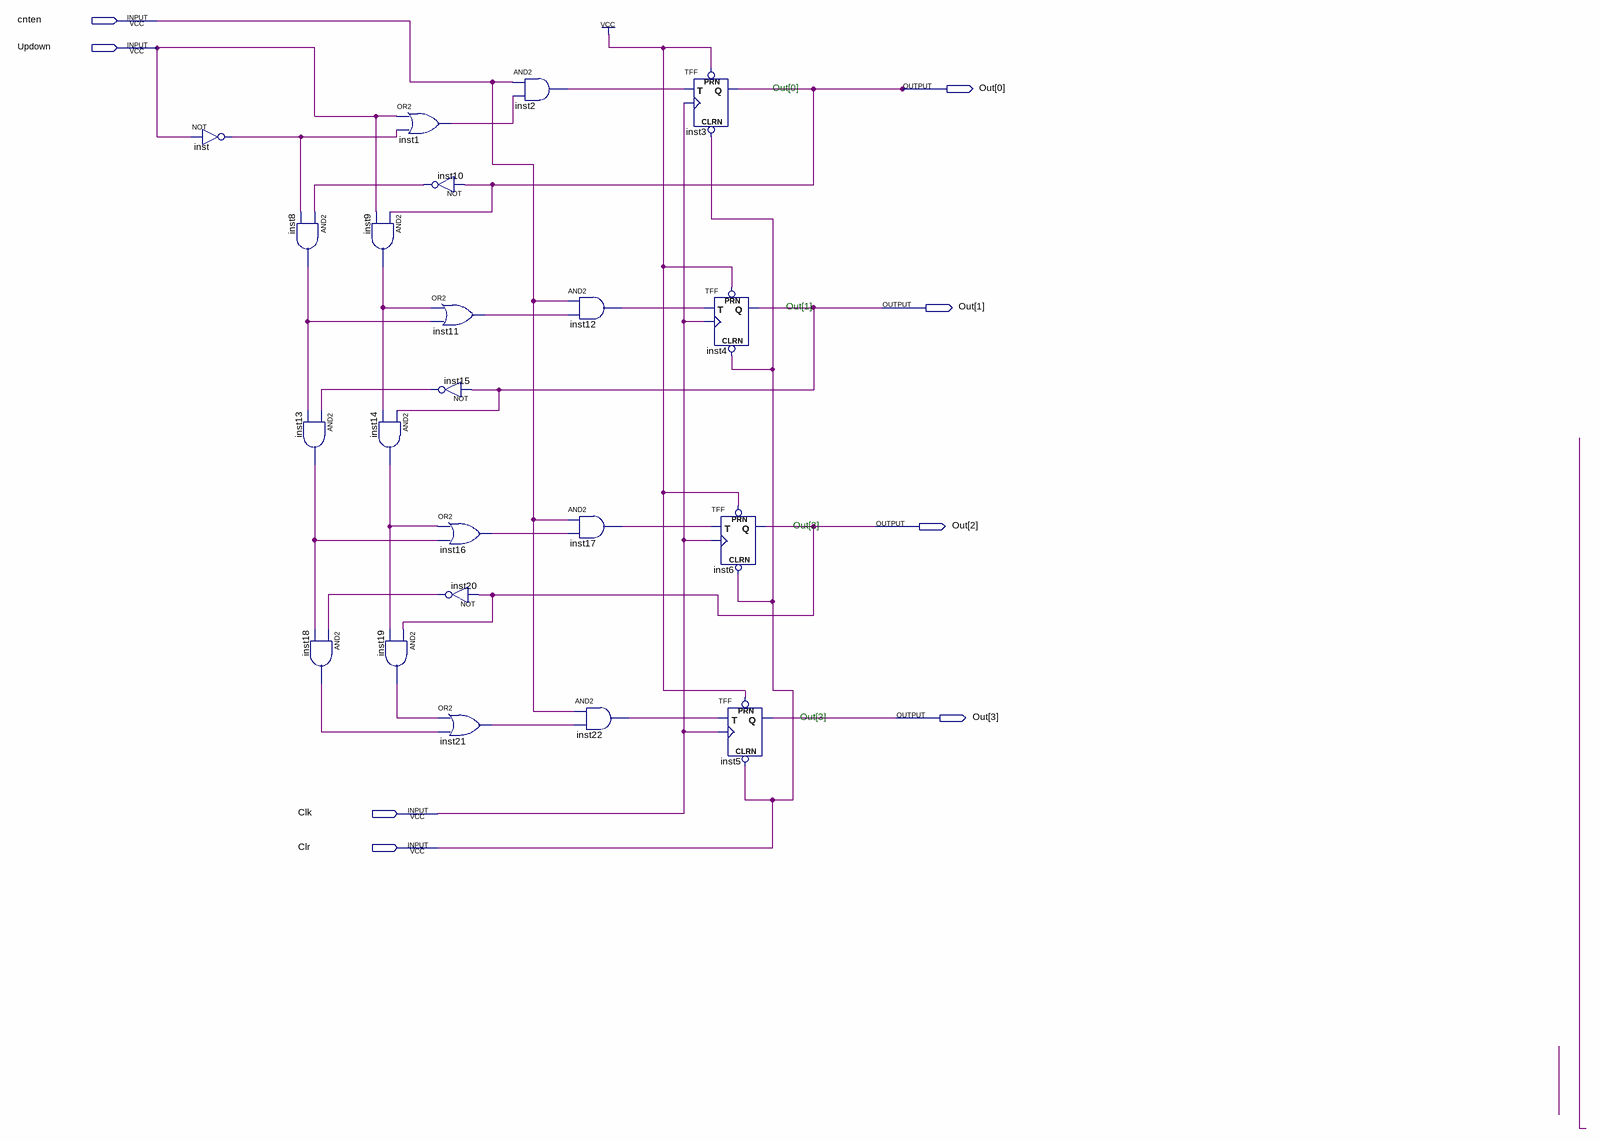
[diagram p0: schematic sheet]
// Quartus schematic counter_4.bdf as structural Verilog: 22 symbols, 8 pins
module counter_4 (
  input  cnten,
  input  Updown,
  input  Clk,
  input  Clr,
  output [3:0] Out
);

  wire inst1_out, inst2_out, inst8_out, inst9_out, inst10_out, inst11_out, inst12_out, inst13_out,
       inst14_out, inst15_out, inst16_out, inst17_out, inst18_out, inst19_out, inst20_out, inst21_out,
       inst22_out, inst_out;

  not inst (inst_out, Updown);
  and inst8 (inst8_out, inst10_out, inst_out);
  and inst13 (inst13_out, inst15_out, inst8_out);
  and inst18 (inst18_out, inst20_out, inst13_out);
  or inst1 (inst1_out, Updown, inst_out);
  and inst9 (inst9_out, Out[0], Updown);
  and inst14 (inst14_out, Out[1], inst9_out);
  and inst19 (inst19_out, Out[2], inst14_out);
  not inst10 (inst10_out, Out[0]);
  or inst11 (inst11_out, inst9_out, inst8_out);
  not inst15 (inst15_out, Out[1]);
  or inst16 (inst16_out, inst14_out, inst13_out);
  not inst20 (inst20_out, Out[2]);
  or inst21 (inst21_out, inst19_out, inst18_out);
  and inst2 (inst2_out, cnten, inst1_out);
  and inst12 (inst12_out, cnten, inst11_out);
  and inst17 (inst17_out, cnten, inst16_out);
  and inst22 (inst22_out, cnten, inst21_out);
  TFF inst3 (.PRN(1'b1), .CLRN(Clr), .T(inst2_out), .CLK(Clk), .Q(Out[0]));
  TFF inst4 (.PRN(1'b1), .CLRN(Clr), .T(inst12_out), .CLK(Clk), .Q(Out[1]));
  TFF inst6 (.PRN(1'b1), .CLRN(Clr), .T(inst17_out), .CLK(Clk), .Q(Out[2]));
  TFF inst5 (.PRN(1'b1), .CLRN(Clr), .T(inst22_out), .CLK(Clk), .Q(Out[3]));

  // Notes on the sheet:
  //   Out[0]
  //   Out[1]
  //   Out[2]
  //   Out[3]
endmodule
